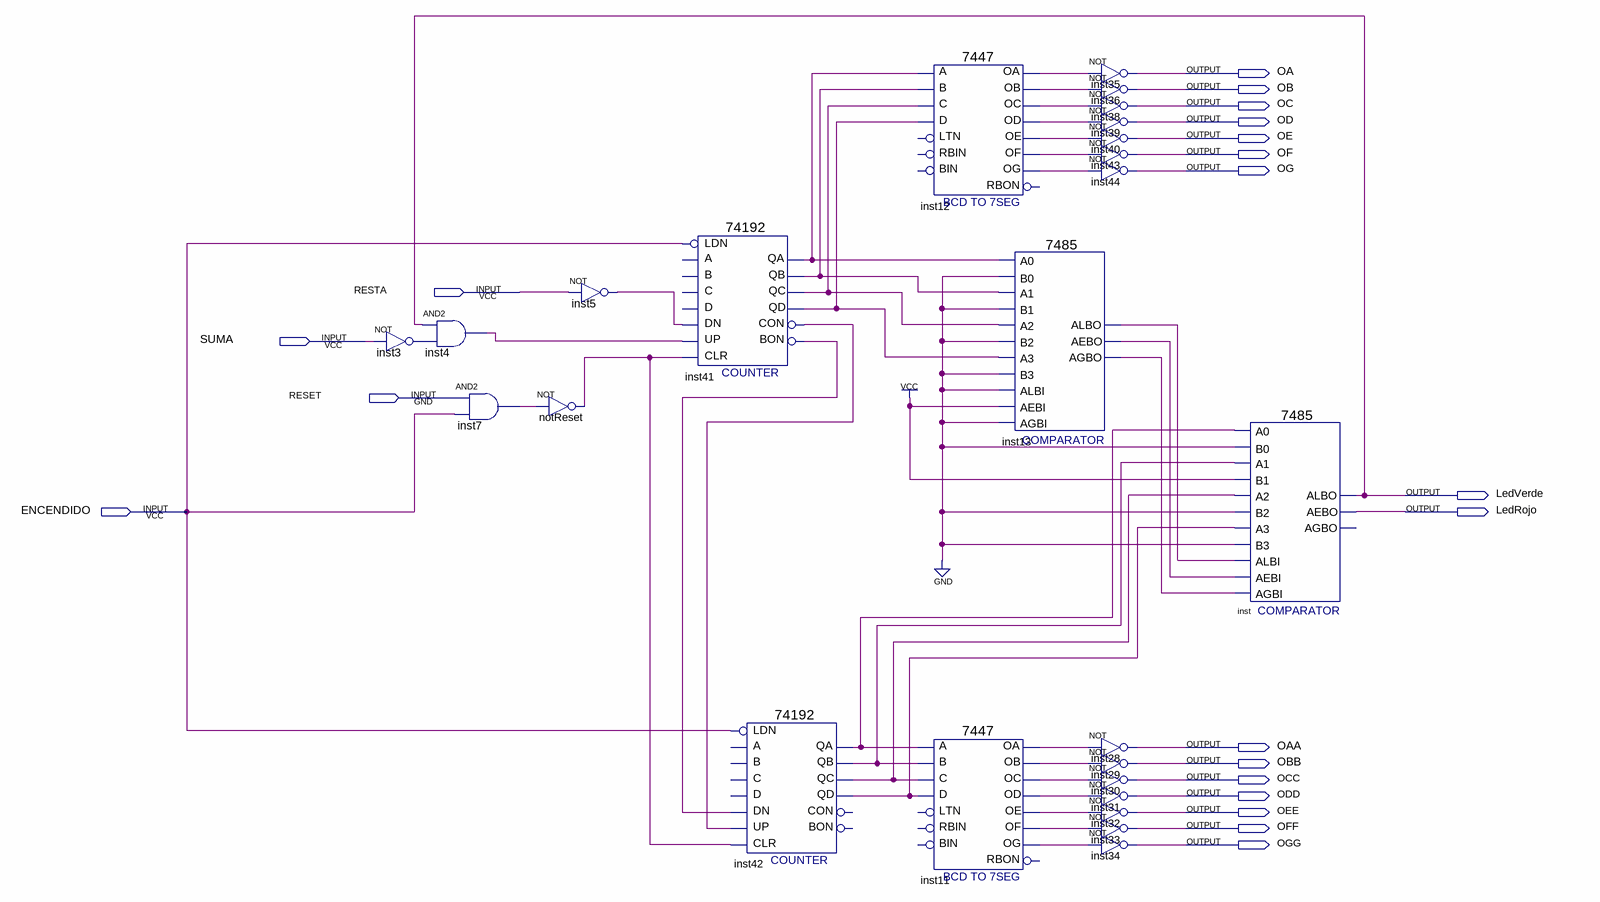
[diagram p0: schematic sheet]
// Quartus schematic prueba7493.bdf as structural Verilog: 25 symbols, 20 pins
module prueba7493 (
  input  RESTA,
  input  SUMA,
  input  RESET,
  input  ENCENDIDO,
  output OA,
  output OB,
  output OC,
  output OD,
  output OE,
  output OF,
  output OG,
  output LedVerde,
  output LedRojo,
  output OAA,
  output OBB,
  output OCC,
  output ODD,
  output OEE,
  output OFF,
  output OGG
);

  wire inst3_out, inst4_out, inst5_out, inst7_out, inst11_oa, inst11_ob, inst11_oc, inst11_od, inst11_oe,
       inst11_of, inst11_og, inst12_oa, inst12_ob, inst12_oc, inst12_od, inst12_oe, inst12_of, inst12_og,
       inst13_aebo, inst13_agbo, inst13_albo, inst41_bon, inst41_con, inst41_qa, inst41_qb, inst41_qc,
       inst41_qd, inst42_qa, inst42_qb, inst42_qc, inst42_qd, notReset_out;

  not inst3 (inst3_out, SUMA);
  and inst4 (inst4_out, LedVerde, inst3_out);
  and inst7 (inst7_out, RESET, ENCENDIDO);
  not inst5 (inst5_out, RESTA);
  not notReset (notReset_out, inst7_out);
  \74192  inst41 (
    .CLR(notReset_out), .UP(inst4_out), .DN(inst5_out), .LDN(ENCENDIDO), .QB(inst41_qb), .BON(inst41_bon),
    .CON(inst41_con), .QA(inst41_qa), .QC(inst41_qc), .QD(inst41_qd));  // open: D, C, A, B
  \74192  inst42 (
    .CLR(notReset_out), .UP(inst41_con), .DN(inst41_bon), .LDN(ENCENDIDO), .QB(inst42_qb), .QA(inst42_qa),
    .QC(inst42_qc), .QD(inst42_qd));  // open: D, C, A, B, BON, CON
  \7447  inst12 (
    .B(inst41_qb), .C(inst41_qc), .D(inst41_qd), .A(inst41_qa), .OB(inst12_ob), .OC(inst12_oc),
    .OE(inst12_oe), .OD(inst12_od), .OF(inst12_of), .OG(inst12_og), .OA(inst12_oa));  // open: LTN, RBIN, BIN, RBON
  \7447  inst11 (
    .B(inst42_qb), .C(inst42_qc), .D(inst42_qd), .A(inst42_qa), .OB(inst11_ob), .OC(inst11_oc),
    .OE(inst11_oe), .OD(inst11_od), .OF(inst11_of), .OG(inst11_og), .OA(inst11_oa));  // open: LTN, RBIN, BIN, RBON
  \7485  inst13 (
    .A3(inst41_qd), .B2(1'b0), .A2(inst41_qc), .AEBI(1'b1), .AGBI(1'b0), .ALBI(1'b0), .A0(inst41_qa),
    .B0(1'b0), .B3(1'b0), .A1(inst41_qb), .B1(1'b0), .ALBO(inst13_albo), .AGBO(inst13_agbo),
    .AEBO(inst13_aebo));
  not inst35 (OA, inst12_oa);
  not inst36 (OB, inst12_ob);
  not inst38 (OC, inst12_oc);
  not inst39 (OD, inst12_od);
  not inst40 (OE, inst12_oe);
  not inst43 (OF, inst12_of);
  not inst44 (OG, inst12_og);
  not inst28 (OAA, inst11_oa);
  not inst29 (OBB, inst11_ob);
  not inst30 (OCC, inst11_oc);
  not inst31 (ODD, inst11_od);
  not inst32 (OEE, inst11_oe);
  not inst33 (OFF, inst11_of);
  not inst34 (OGG, inst11_og);
  \7485  inst (
    .A3(inst42_qd), .B2(1'b0), .A2(inst42_qc), .AEBI(inst13_aebo), .AGBI(inst13_agbo), .ALBI(inst13_albo),
    .A0(inst42_qa), .B0(1'b0), .B3(1'b0), .A1(inst42_qb), .B1(1'b1), .ALBO(LedVerde), .AEBO(LedRojo));  // open: AGBO
endmodule
